# EAGLE design 009pcb4_12mil (EAGLE 9.6.2)
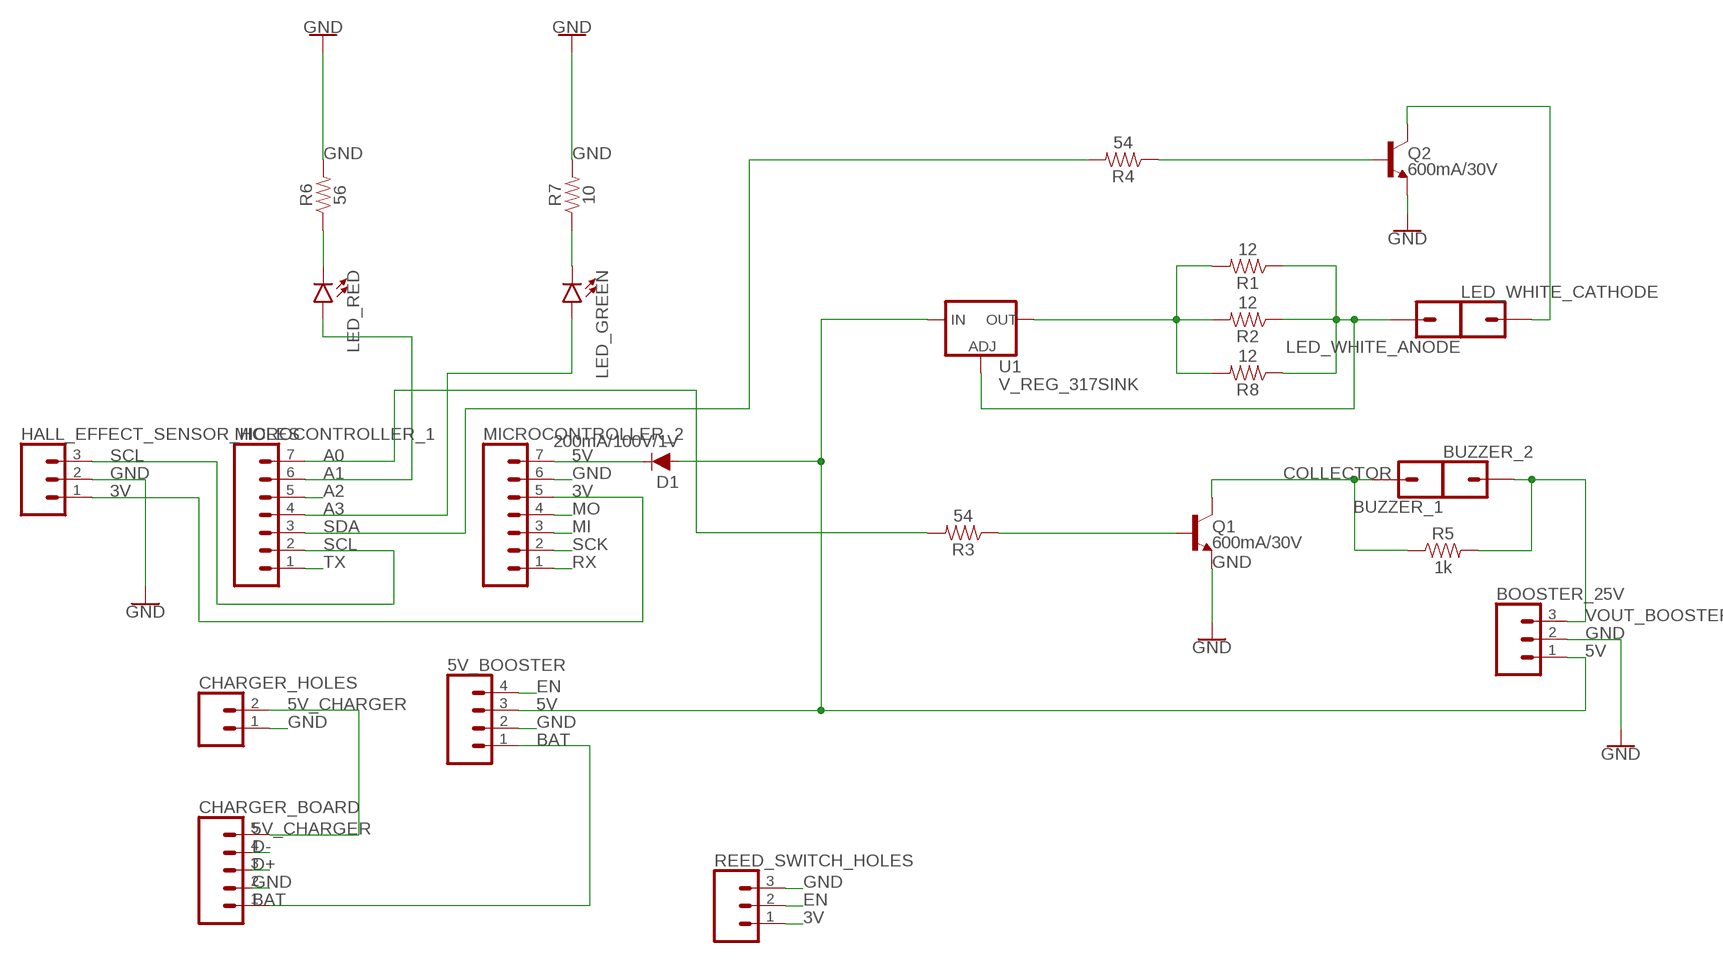
[diagram p0: schematic, sheet 1]

## Parts
5V_BOOSTER  CONN_04  [1X04]
BOOSTER_25V  CONN_03  [1X03]
BUZZER_1  CONN_01  [1X01]
BUZZER_2  CONN_01  [1X01]
CHARGER_BOARD  CONN_05  [1X05]
CHARGER_HOLES  CONN_02  [1X02]
D1  200mA/100V/1V  DIODE-1N4148  [DIODE-1N4148]
HALL_EFFECT_SENSOR_HOLES  CONN_03  [1X03]
LED_GREEN  LED5MM  [LED_5MM]
LED_RED  LED5MM  [LED_5MM]
LED_WHITE_ANODE  CONN_01  [1X01]
LED_WHITE_CATHODE  CONN_01  [1X01]
MICROCONTROLLER_1  CONN_07  [1X07]
MICROCONTROLLER_2  CONN_07  [1X07]
Q1  600mA/30V  TRANS_NPN-2N3904  [TO-92]
Q2  600mA/30V  TRANS_NPN-2N3904  [TO-92]
R1  12  10OHM-HORIZ-1/4W-1%  [AXIAL-0.3]
R2  12  10OHM-HORIZ-1/4W-1%  [AXIAL-0.3]
R3  54  10OHM-HORIZ-1/4W-1%  [AXIAL-0.3]
R4  54  10OHM-HORIZ-1/4W-1%  [AXIAL-0.3]
R5  1k  1KOHM-HORIZ-1/4W-1%  [AXIAL-0.3]
R6  56  10OHM-HORIZ-1/4W-1%  [AXIAL-0.3]
R7  10  10OHM-HORIZ-1/4W-1%  [AXIAL-0.3]
R8  12  10OHM-HORIZ-1/4W-1%  [AXIAL-0.3]
REED_SWITCH_HOLES  CONN_03  [1X03]
U1  V_REG_317SINK  [TO220-ADJ]

## Nets
3V: HALL_EFFECT_SENSOR_HOLES.1 MICROCONTROLLER_2.5 REED_SWITCH_HOLES.1
5V: 5V_BOOSTER.3 BOOSTER_25V.1 D1.A U1.IN
5V_CHARGER: CHARGER_BOARD.5 CHARGER_HOLES.2
A0: MICROCONTROLLER_1.7 R3.P$2
A1: LED_RED.A MICROCONTROLLER_1.6
A2: MICROCONTROLLER_1.5
A3: LED_GREEN.A MICROCONTROLLER_1.4
ADJUST: LED_WHITE_ANODE.1 R1.P$1 R2.P$1 R8.P$1 U1.ADJ
BASE: Q1.2(B) Q2.2(B) R3.P$1 R4.P$1
BAT: 5V_BOOSTER.1 CHARGER_BOARD.1
COLLECTOR: BUZZER_1.1 LED_WHITE_CATHODE.1 Q1.3(C) Q2.3(C) R5.P$1
D+: CHARGER_BOARD.3
D-: CHARGER_BOARD.4
EN: 5V_BOOSTER.4 REED_SWITCH_HOLES.2
GND: 5V_BOOSTER.2 BOOSTER_25V.2 CHARGER_BOARD.2 CHARGER_HOLES.1 HALL_EFFECT_SENSOR_HOLES.2 MICROCONTROLLER_2.6 Q1.1(E) Q2.1(E) R6.P$2 R7.P$2 REED_SWITCH_HOLES.3
MI: MICROCONTROLLER_2.3
MO: MICROCONTROLLER_2.4
N$1: LED_RED.K(C) R6.P$1
N$3: LED_GREEN.K(C) R7.P$1
N$6: D1.C MICROCONTROLLER_2.7
RX: MICROCONTROLLER_2.1
SCK: MICROCONTROLLER_2.2
SCL: HALL_EFFECT_SENSOR_HOLES.3 MICROCONTROLLER_1.2
SDA: MICROCONTROLLER_1.3 R4.P$2
TX: MICROCONTROLLER_1.1
VOUT_BOOSTER: BOOSTER_25V.3 BUZZER_2.1 R5.P$2
VOUT_LM317: R1.P$2 R2.P$2 R8.P$2 U1.OUT

## Library data of the parts
5V_BOOSTER = SparkFun-Connectors:CONN_04: Multi connection point. Often used as Generic Header-pin footprint for 0.1 inch spaced/style header connections On any of the 0.1 inch spaced packages, you can populate with these: Break Away Headers - Straight <https://www.sparkfun.com/products/116> (PRT-00116) Break Away Male Headers - Right Angle <https://www.sparkfun.com/products/553> (PRT-00553) Female Headers <https://www.sparkfun.com/products/115> (PRT-00115) Break Away Headers - Machine Pin <https://www.sparkfun.com/products/117> (PRT-00117) Break Away Female Headers - Swiss Machine Pin <https://www.sparkfun.com/products/743> (PRT-00743) For SCREWTERMINALS and SPRING TERMINALS visit here: Screw Terimnals on SparkFun.com <https://www.sparkfun.com/search/results?term=Screw+Terminals> (5mm/3.5mm/2.54mm spacing) This device is also useful as a general connection point to wire up your design to another part of your project. Our various solder wires solder well into these plated through hole pads. Hook-Up Wire - Assortment (Stranded, 22 AWG) <https://www.sparkfun.com/products/11375> (PRT-11375) Hook-Up Wire - Assortment (Solid Core, 22 AWG) <https://www.sparkfun.com/products/11367> (PRT-11367) View the entire wire category on our website here <https://www.sparkfun.com/categories/141> Special notes: Molex polarized connector foot print use with SKU : PRT-08231 with associated crimp pins and housings. 1MM SMD Version SKU: PRT-10208; PROD_ID: CONN-09696
BOOSTER_25V HALL_EFFECT_SENSOR_HOLES REED_SWITCH_HOLES = SparkFun-Connectors:CONN_03: Multi connection point. Often used as Generic Header-pin footprint for 0.1 inch spaced/style header connections On any of the 0.1 inch spaced packages, you can populate with these: Break Away Headers - Straight <https://www.sparkfun.com/products/116> (PRT-00116) Break Away Male Headers - Right Angle <https://www.sparkfun.com/products/553> (PRT-00553) Female Headers <https://www.sparkfun.com/products/115> (PRT-00115) Break Away Headers - Machine Pin <https://www.sparkfun.com/products/117> (PRT-00117) Break Away Female Headers - Swiss Machine Pin <https://www.sparkfun.com/products/743> (PRT-00743) Stackable Header - 3 Pin (Female, 0.1") <https://www.sparkfun.com/products/13875> (PRT-13875) For SCREWTERMINALS and SPRING TERMINALS visit here: Screw Terimnals on SparkFun.com <https://www.sparkfun.com/search/results?term=Screw+Terminals> (5mm/3.5mm/2.54mm spacing) This device is also useful as a general connection point to wire up your design to another part of your project. Our various solder wires solder well into these plated through hole pads. Hook-Up Wire - Assortment (Stranded, 22 AWG) <https://www.sparkfun.com/products/11375> (PRT-11375) Hook-Up Wire - Assortment (Solid Core, 22 AWG) <https://www.sparkfun.com/products/11367> (PRT-11367) View the entire wire category on our website here <https://www.sparkfun.com/categories/141> Special notes: Molex polarized connector foot print use with SKU : PRT-08232 with associated crimp pins and housings.
BUZZER_1 BUZZER_2 LED_WHITE_ANODE LED_WHITE_CATHODE = SparkFun-Connectors:CONN_01: Single connection point. Often used as Generic Header-pin footprint for 0.1 inch spaced/style header connections On any of the 0.1 inch spaced packages, you can populate with these: Break Away Headers - Straight <https://www.sparkfun.com/products/116> (PRT-00116) Break Away Male Headers - Right Angle <https://www.sparkfun.com/products/553> (PRT-00553) Female Headers <https://www.sparkfun.com/products/115> (PRT-00115) Break Away Headers - Machine Pin <https://www.sparkfun.com/products/117> (PRT-00117) Break Away Female Headers - Swiss Machine Pin <https://www.sparkfun.com/products/743> (PRT-00743) This device is also useful as a general connection point to wire up your design to another part of your project. Our various solder wires solder well into these plated through hole pads. Hook-Up Wire - Assortment (Stranded, 22 AWG) <https://www.sparkfun.com/products/11375> (PRT-11375) Hook-Up Wire - Assortment (Solid Core, 22 AWG) <https://www.sparkfun.com/products/11367> (PRT-11367) View the entire wire category on our website here <https://www.sparkfun.com/categories/141> Special notes: SMTSO-256-ET is a "flush mount" nut for a 4-40 screw. We mostly use this on specialty testbeds; it is a nice way to connect hardware to your PCB at an adjustable hieght. Also note, the SNAP packages are for using a snappable style connector. We sell a baggie of snaps and they are also used on two LilyPad designs: Snap Assortment - 30 pack (male and female) <https://www.sparkfun.com/products/11347> (DEV-11347) LilyPad Arduino SimpleSnap <https://www.sparkfun.com/products/10941> (DEV-10941) LilyPad SimpleSnap Protoboard <https://www.sparkfun.com/products/10940> (DEV-10940)
CHARGER_BOARD = SparkFun-Connectors:CONN_05: Multi connection point. Often used as Generic Header-pin footprint for 0.1 inch spaced/style header connections On any of the 0.1 inch spaced packages, you can populate with these: Break Away Headers - Straight <https://www.sparkfun.com/products/116> (PRT-00116) Break Away Male Headers - Right Angle <https://www.sparkfun.com/products/553> (PRT-00553) Female Headers <https://www.sparkfun.com/products/115> (PRT-00115) Break Away Headers - Machine Pin <https://www.sparkfun.com/products/117> (PRT-00117) Break Away Female Headers - Swiss Machine Pin <https://www.sparkfun.com/products/743> (PRT-00743) For SCREWTERMINALS and SPRING TERMINALS visit here: Screw Terimnals on SparkFun.com <https://www.sparkfun.com/search/results?term=Screw+Terminals> (5mm/3.5mm/2.54mm spacing) This device is also useful as a general connection point to wire up your design to another part of your project. Our various solder wires solder well into these plated through hole pads. Hook-Up Wire - Assortment (Stranded, 22 AWG) <https://www.sparkfun.com/products/11375> (PRT-11375) Hook-Up Wire - Assortment (Solid Core, 22 AWG) <https://www.sparkfun.com/products/11367> (PRT-11367) View the entire wire category on our website here <https://www.sparkfun.com/categories/141> Special notes: Molex polarized connector foot print use with SKU : PRT-08231 with associated crimp pins and housings. 1MM SMD Version SKU: PRT-10208
CHARGER_HOLES = SparkFun-Connectors:CONN_02: Multi connection point. Often used as Generic Header-pin footprint for 0.1 inch spaced/style header connections On any of the 0.1 inch spaced packages, you can populate with these: Break Away Headers - Straight <https://www.sparkfun.com/products/116> (PRT-00116) Break Away Male Headers - Right Angle <https://www.sparkfun.com/products/553> (PRT-00553) Female Headers <https://www.sparkfun.com/products/115> (PRT-00115) Break Away Headers - Machine Pin <https://www.sparkfun.com/products/117> (PRT-00117) Break Away Female Headers - Swiss Machine Pin <https://www.sparkfun.com/products/743> (PRT-00743) For SCREWTERMINALS and SPRING TERMINALS visit here: Screw Terimnals on SparkFun.com <https://www.sparkfun.com/search/results?term=Screw+Terminals> (5mm/3.5mm/2.54mm spacing) This device is also useful as a general connection point to wire up your design to another part of your project. Our various solder wires solder well into these plated through hole pads. Hook-Up Wire - Assortment (Stranded, 22 AWG) <https://www.sparkfun.com/products/11375> (PRT-11375) Hook-Up Wire - Assortment (Solid Core, 22 AWG) <https://www.sparkfun.com/products/11367> (PRT-11367) View the entire wire category on our website here <https://www.sparkfun.com/categories/141> Special notes: Molex polarized connector foot print use with: PRT-08233 with associated crimp pins and housings. 2.54_SCREWTERM for use with PRT-10571. 3.5mm Screw Terminal footprints for PRT-08084 5mm Screw Terminal footprints for use with PRT-08432
D1 = SparkFun-DiscreteSemi:DIODE: Diode These are standard reverse protection diodes and small signal diodes. SparkFun Products: SparkFun SparkPunk Sound Kit <https://www.sparkfun.com/products/11177> SparkFun ESP8266 Thing <https://www.sparkfun.com/products/13231>; PROD_ID: DIO-08378
LED_GREEN LED_RED = SparkFun-LED:LED: LED (Generic) Standard schematic elements and footprints for 5mm, 3mm, 1206, and 0603 sized LEDs. Generic LEDs with no color specified.
MICROCONTROLLER_1 MICROCONTROLLER_2 = SparkFun-Connectors:CONN_07: Multi connection point. Often used as Generic Header-pin footprint for 0.1 inch spaced/style header connections On any of the 0.1 inch spaced packages, you can populate with these: Break Away Headers - Straight <https://www.sparkfun.com/products/116> (PRT-00116) Break Away Male Headers - Right Angle <https://www.sparkfun.com/products/553> (PRT-00553) Female Headers <https://www.sparkfun.com/products/115> (PRT-00115) Break Away Headers - Machine Pin <https://www.sparkfun.com/products/117> (PRT-00117) Break Away Female Headers - Swiss Machine Pin <https://www.sparkfun.com/products/743> (PRT-00743) For SCREWTERMINALS and SPRING TERMINALS visit here: Screw Terimnals on SparkFun.com <https://www.sparkfun.com/search/results?term=Screw+Terminals> (5mm/3.5mm/2.54mm spacing) This device is also useful as a general connection point to wire up your design to another part of your project. Our various solder wires solder well into these plated through hole pads. Hook-Up Wire - Assortment (Stranded, 22 AWG) <https://www.sparkfun.com/products/11375> (PRT-11375) Hook-Up Wire - Assortment (Solid Core, 22 AWG) <https://www.sparkfun.com/products/11367> (PRT-11367) View the entire wire category on our website here <https://www.sparkfun.com/categories/141> Special notes: Molex polarized connector foot print use with SKU : PRT-08231 with associated crimp pins and housings. 1MM SMD Version SKU: PRT-10208 NOTES ON THE VARIANTS LOCK and LOCK_LONGPADS... This footprint was designed to help hold the alignment of a through-hole component (i.e. 6-pin header) while soldering it into place. You may notice that each hole has been shifted either up or down by 0.005 of an inch from it's more standard position (which is a perfectly straight line). This slight alteration caused the pins (the squares in the middle) to touch the edges of the holes. Because they are alternating, it causes a "brace" to hold the component in place. 0.005 has proven to be the perfect amount of "off-center" position when using our standard breakaway headers. Although looks a little odd when you look at the bare footprint, once you have a header in there, the alteration is very hard to notice. Also,if you push a header all the way into place, it is covered up entirely on the bottom side.
Q1 Q2 = SparkFun-DiscreteSemi:TRANS_NPN: NPN transistor Current controlled devices typically used to amplify current or used as a switch. BC547 - COM-08928 <http://www.sparkfun.com/products/8928> (TO-92 45V 100mA) (1.Collector 2.Base 3.Emitter) 2N3904 - COM-00521 <http://www.sparkfun.com/products/521> (TO-92 40V 200mA) (1.Emitter 2.Base 3.Collector) P2N2222A - COM-12852 <http://www.sparkfun.com/products/12852> (TO-92 40V 600mA) (1.Collector 2.Base 3.Emitter); PROD_ID: TRANS-08447; VALUE: 200mA/40V
R1-R4 R6 R8 = SparkFun-Resistors:10OHM: 10Ω resistor A resistor is a passive two-terminal electrical component that implements electrical resistance as a circuit element. Resistors act to reduce current flow, and, at the same time, act to lower voltage levels within circuits. - Wikipedia; PROD_ID: RES-12180; VALUE: 10
R5 = SparkFun-Resistors:1KOHM: 1kΩ resistor A resistor is a passive two-terminal electrical component that implements electrical resistance as a circuit element. Resistors act to reduce current flow, and, at the same time, act to lower voltage levels within circuits. - Wikipedia; PROD_ID: RES-12182
R7 = SparkFun-Resistors:10OHM: 10Ω resistor A resistor is a passive two-terminal electrical component that implements electrical resistance as a circuit element. Resistors act to reduce current flow, and, at the same time, act to lower voltage levels within circuits. - Wikipedia; PROD_ID: RES-12180
U1 = SparkFun-IC-Power:V_REG_317: Voltage Regulator Standard LM317 adjustable voltage regulator. AOI (Adjust Output Input). Google 'LM317 Calculator' for easy to use app to get the two resistor values needed. 240/720 for 5V output. 240/390 for 3.3V output. Spark Fun Electronics SKU : COM-00527

## Board
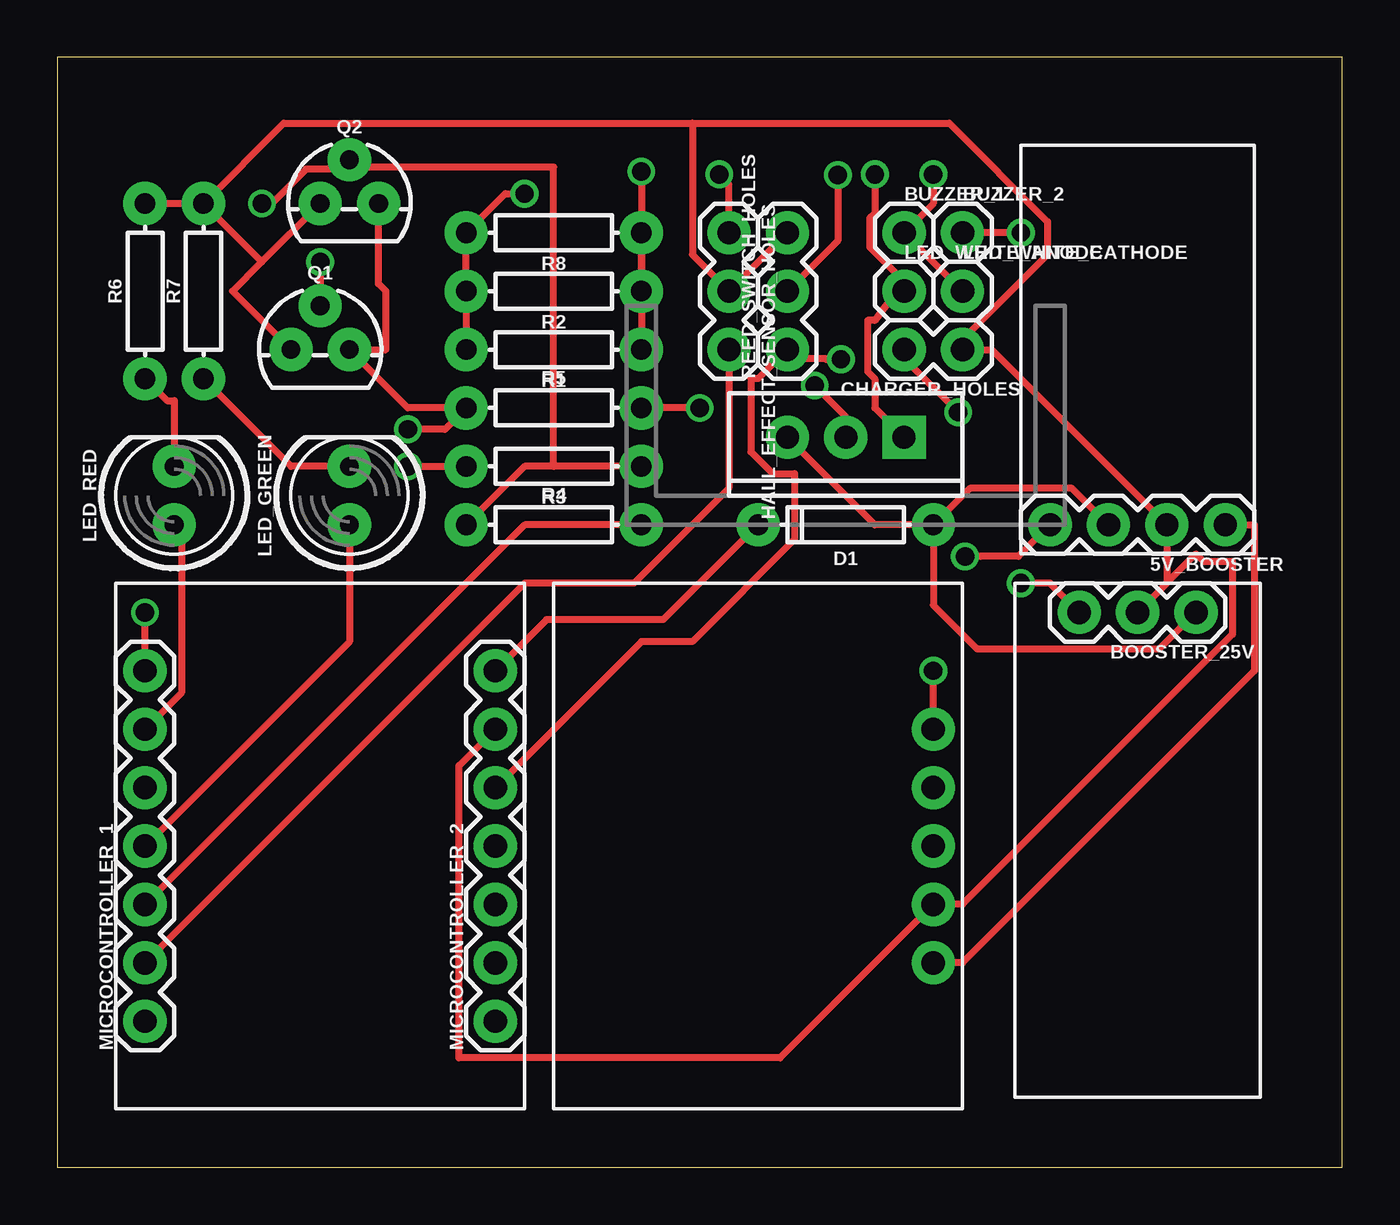
[diagram p1: board, top side]
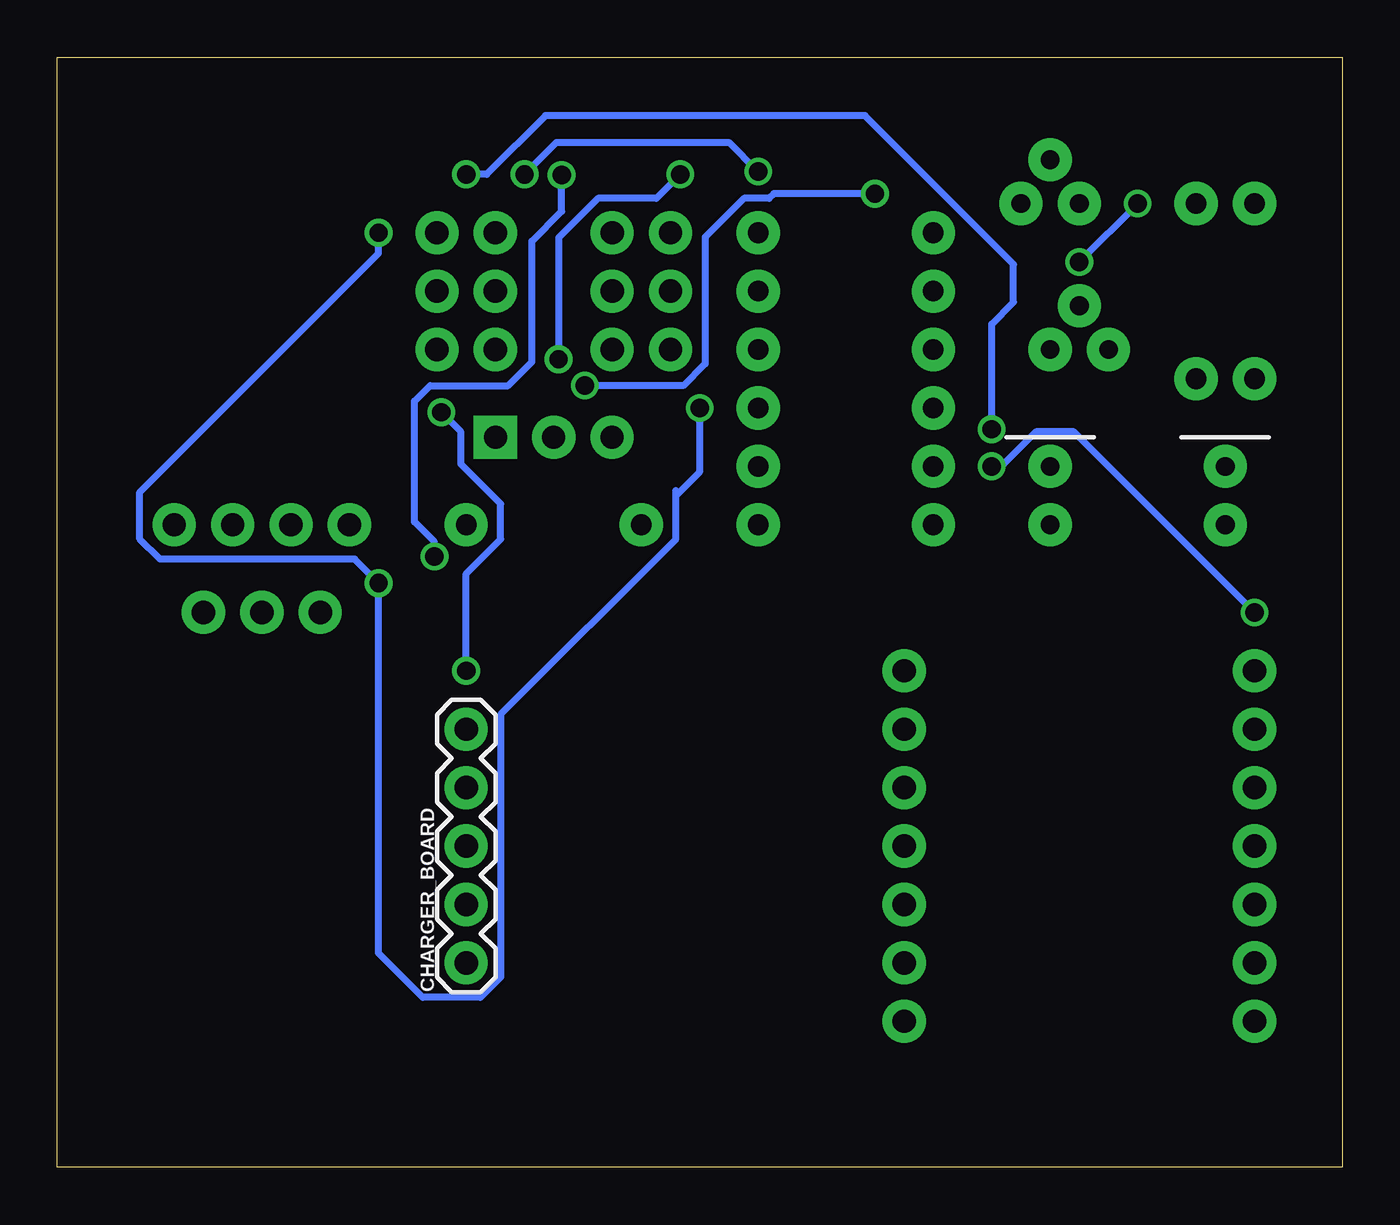
[diagram p2: board, bottom side, seen from below]

Size 55.88 x 48.26 mm. Coordinates in mm from the lower left corner, seen from the top.
Outline: 0,0 55.88,0 55.88,48.26 0,48.26 0,0
Copper layers (1*16): Top 0.035mm / dielectric 1.5mm / Bottom 0.035mm
Design rules "default *": minimum track width 12mil, minimum drill 0.8mm, track to track 16mil, track to pad 16mil, pad to pad 16mil, via to via 16mil, smd to smd 16mil, copper to edge 40mil, drill to drill 6mil, minimum pad ring 10mil, minimum via ring 8mil, stop-mask expansion 4mil, vias tented up to drill 0mil, thermal gap 10mil

### Footprints (pad centres in the part's own frame; a part is rotated, then mirrored left to right if it is on the bottom)
1X04 = drill 1.016 pad 1.88: 1 0,0; 2 2.54,0; 3 5.08,0; 4 7.62,0
1X03 = drill 1.016 pad 1.88: 1 0,0; 2 2.54,0; 3 5.08,0
1X01 = drill 1.016 pad 1.88: 1 0,0
1X05 = drill 1.016 pad 1.88: 1 0,0; 2 2.54,0; 3 5.08,0; 4 7.62,0; 5 10.16,0
1X02 = drill 1.016 pad 1.88: 1 0,0; 2 2.54,0
DIODE-1N4148 = drill 0.9 pad 1.88: A -3.81,0; C 3.81,0
LED_5MM = drill 0.813 pad 1.88: A -1.27,0; K 1.27,0
1X07 = drill 1.016 pad 1.88: 1 0,0; 2 2.54,0; 3 5.08,0; 4 7.62,0; 5 10.16,0; 6 12.7,0; 7 15.24,0
TO-92 = drill 0.813 pad 1.88: 1 -1.27,0; 2 0,1.905; 3 1.27,0
AXIAL-0.3 = drill 0.9 pad 1.88: P$1 -3.81,0; P$2 3.81,0
TO220-ADJ = drill 1 pad 1.88 square: ADJ -2.54,0 | drill 1 pad 1.88: IN 2.54,0; OUT 0,0

### Placement (x,y rotation side)
5V_BOOSTER  50.8,27.94 180 top
BOOSTER_25V  49.53,24.13 180 top
BUZZER_1  36.83,40.64 0 top
BUZZER_2  39.37,40.64 0 top
CHARGER_BOARD  38.1,8.89 90 bottom
CHARGER_HOLES  39.37,35.56 180 top
D1  34.29,27.94 180 top
HALL_EFFECT_SENSOR_HOLES  29.21,40.64 270 top
LED_GREEN  12.7,29.21 90 top
LED_RED  5.08,29.21 90 top
LED_WHITE_ANODE  36.83,38.1 0 top
LED_WHITE_CATHODE  39.37,38.1 0 top
MICROCONTROLLER_1  3.81,6.35 90 top
MICROCONTROLLER_2  19.05,6.35 90 top
Q1  11.43,35.56 0 top
Q2  12.7,41.91 0 top
R1  21.59,35.56 180 top
R2  21.59,38.1 180 top
R3  21.59,30.48 180 top
R4  21.59,27.94 0 top
R5  21.59,33.02 0 top
R6  3.81,38.1 90 top
R7  6.35,38.1 90 top
R8  21.59,40.64 180 top
REED_SWITCH_HOLES  31.75,35.56 90 top
U1  34.29,31.75 180 top

### Tracks (layer width: path | path; a pad name or v marks a point on that pad's centre or on a via)
3V  (via drill 0.8)
  Top 0.305: MICROCONTROLLER_2.5 25.4,22.86 27.62,22.86 32.07,27.3 32.07,30.16 31.11,30.16 30.16,31.11 30.16,34.29 30.48,34.29 REED_SWITCH_HOLES.1 32.15,35.16 33.42,35.16 33.44,35.14 v34.08,35.14 | HALL_EFFECT_SENSOR_HOLES.1 29.21,42.76 v28.79,43.18
  Bottom 0.305: v28.79,43.18 29.83,42.14 32.37,42.14 34.08,40.43 v34.08,35.14
5V
  Top 0.305: D1.A 39.69,29.53 44.13,29.53 5V_BOOSTER.3 | BOOSTER_25V.1 47.94,22.54 40.01,22.54 38.1,24.45 D1.A | U1.IN 35.56,27.94 D1.A
5V_CHARGER  (via drill 0.8)
  Top 0.305: CHARGER_BOARD.5 v38.1,21.59 | CHARGER_HOLES.2 36.83,35.19 v39.18,32.83
  Bottom 0.305: v39.18,32.83 38.33,31.98 38.33,30.58 36.6,28.85 36.6,27.32 38.1,25.82 v38.1,21.59
A0  (via drill 0.8)
  Top 0.305: MICROCONTROLLER_1.7 v3.81,24.13 | v15.24,30.48 R3.P$2
  Bottom 0.305: v15.24,30.48 14.82,30.48 13.32,31.98 11.66,31.98 v3.81,24.13
A1
  Top 0.305: MICROCONTROLLER_1.6 5.4,20.64 5.4,27.94 LED_RED.A
A3
  Top 0.305: MICROCONTROLLER_1.4 12.7,22.86 LED_GREEN.A
ADJUST  (via drill 0.8)
  Top 0.305: R2.P$1 R1.P$1 | R2.P$1 R8.P$1 | U1.ADJ 35.56,33.02 35.56,34.29 35.24,34.61 35.24,36.83 35.56,36.83 36.83,38.52 35.33,40.02 35.33,41.26 35.56,41.49 v35.56,43.18 | v25.4,43.3 R2.P$1
  Bottom 0.305: v25.4,43.3 26.67,44.57 34.17,44.57 v35.56,43.18
BASE  (via drill 0.8)
  Top 0.305: R4.P$1 20.32,30.48 21.59,30.48 | R3.P$1 21.59,30.48 | 21.59,30.48 21.59,43.5 13.02,43.5 Q2.2 12.29,43.41 10.81,43.41 9.31,41.91 v8.89,41.91 | v11.43,39.37 Q1.2
  Bottom 0.305: v8.89,41.91 v11.43,39.37
BAT
  Top 0.305: CHARGER_BOARD.1 39.37,8.89 52.07,21.59 52.07,27.94 5V_BOOSTER.1
COLLECTOR  (via drill 0.8)
  Top 0.305: Q2.3 13.97,38.42 14.29,38.1 14.29,35.56 Q1.3 15.24,33.02 R5.P$1 16.85,32.09 v15.24,32.09 | LED_WHITE_CATHODE.1 BUZZER_1.1 38.1,41.91 v38.1,43.18
  Bottom 0.305: v15.24,32.09 15.24,36.67 14.29,37.62 14.29,39.27 20.75,45.73 34.65,45.73 37.2,43.18 v38.1,43.18
EN  (via drill 0.8)
  Top 0.305: 5V_BOOSTER.4 41.8,26.56 40.16,26.56 v39.48,26.56 | v33.95,43.15 33.95,40.3 REED_SWITCH_HOLES.2
  Bottom 0.305: v33.95,43.15 33.95,41.57 35.24,40.27 35.24,35.03 36.27,33.99 39.66,33.99 40.34,33.31 40.34,28.07 39.48,27.2 v39.48,26.56
GND
  Top 0.305: R7.P$2 8.89,39.37 | Q1.1 7.62,38.1 8.89,39.37 | 8.89,39.37 Q2.1 | REED_SWITCH_HOLES.3 HALL_EFFECT_SENSOR_HOLES.2 27.62,39.69 27.62,45.4 | MICROCONTROLLER_2.6 17.46,17.46 17.46,4.76 31.43,4.76 CHARGER_BOARD.2 39.37,11.43 51.12,23.18 51.12,26.35 49.85,26.35 49.53,26.67 BOOSTER_25V.2 48.26,25.4 5V_BOOSTER.2 | R7.P$2 9.84,45.4 27.62,45.4 | 47.84,27.94 5V_BOOSTER.2 | 5V_BOOSTER.2 40.64,35.56 CHARGER_HOLES.1 39.37,35.98 43.07,39.68 43.07,41.12 38.79,45.4 27.62,45.4 | R7.P$2 R6.P$2
N$1
  Top 0.305: LED_RED.K 5.08,33.34 4.76,33.34 R6.P$1
N$3
  Top 0.305: R7.P$1 10.16,30.48 LED_GREEN.K
N$6
  Top 0.305: MICROCONTROLLER_2.7 21.27,23.81 26.35,23.81 D1.C
SCL
  Top 0.305: MICROCONTROLLER_1.2 20.32,25.4 25.08,25.4 29.21,29.53 HALL_EFFECT_SENSOR_HOLES.3
SDA
  Top 0.305: MICROCONTROLLER_1.3 20.32,27.94 R4.P$2
VOUT_BOOSTER  (via drill 0.8)
  Top 0.305: BOOSTER_25V.3 43.18,25.4 v41.91,25.4 | v41.91,40.64 BUZZER_2.1 | v27.94,33.02 R5.P$2
  Bottom 0.305: v41.91,40.64 41.91,39.74 52.3,29.36 52.3,27.32 51.42,26.44 42.95,26.44 v41.91,25.4 41.91,9.31 39.99,7.39 37.48,7.39 36.6,8.27 36.6,19.7 28.98,27.32 28.98,29.21 | 28.98,29.21 28.98,29.44 | 28.98,29.21 27.94,30.25 v27.94,33.02
VOUT_LM317  (via drill 0.8)
  Top 0.305: R1.P$2 R2.P$2 R8.P$2 19.48,42.34 v20.32,42.34 | v32.94,33.99 34.29,32.65 U1.OUT
  Bottom 0.305: v32.94,33.99 28.66,33.99 27.71,34.94 27.71,40.45 26.02,42.14 24.92,42.14 24.72,42.34 v20.32,42.34